# EAGLE design Wolf (EAGLE 7.2.0)
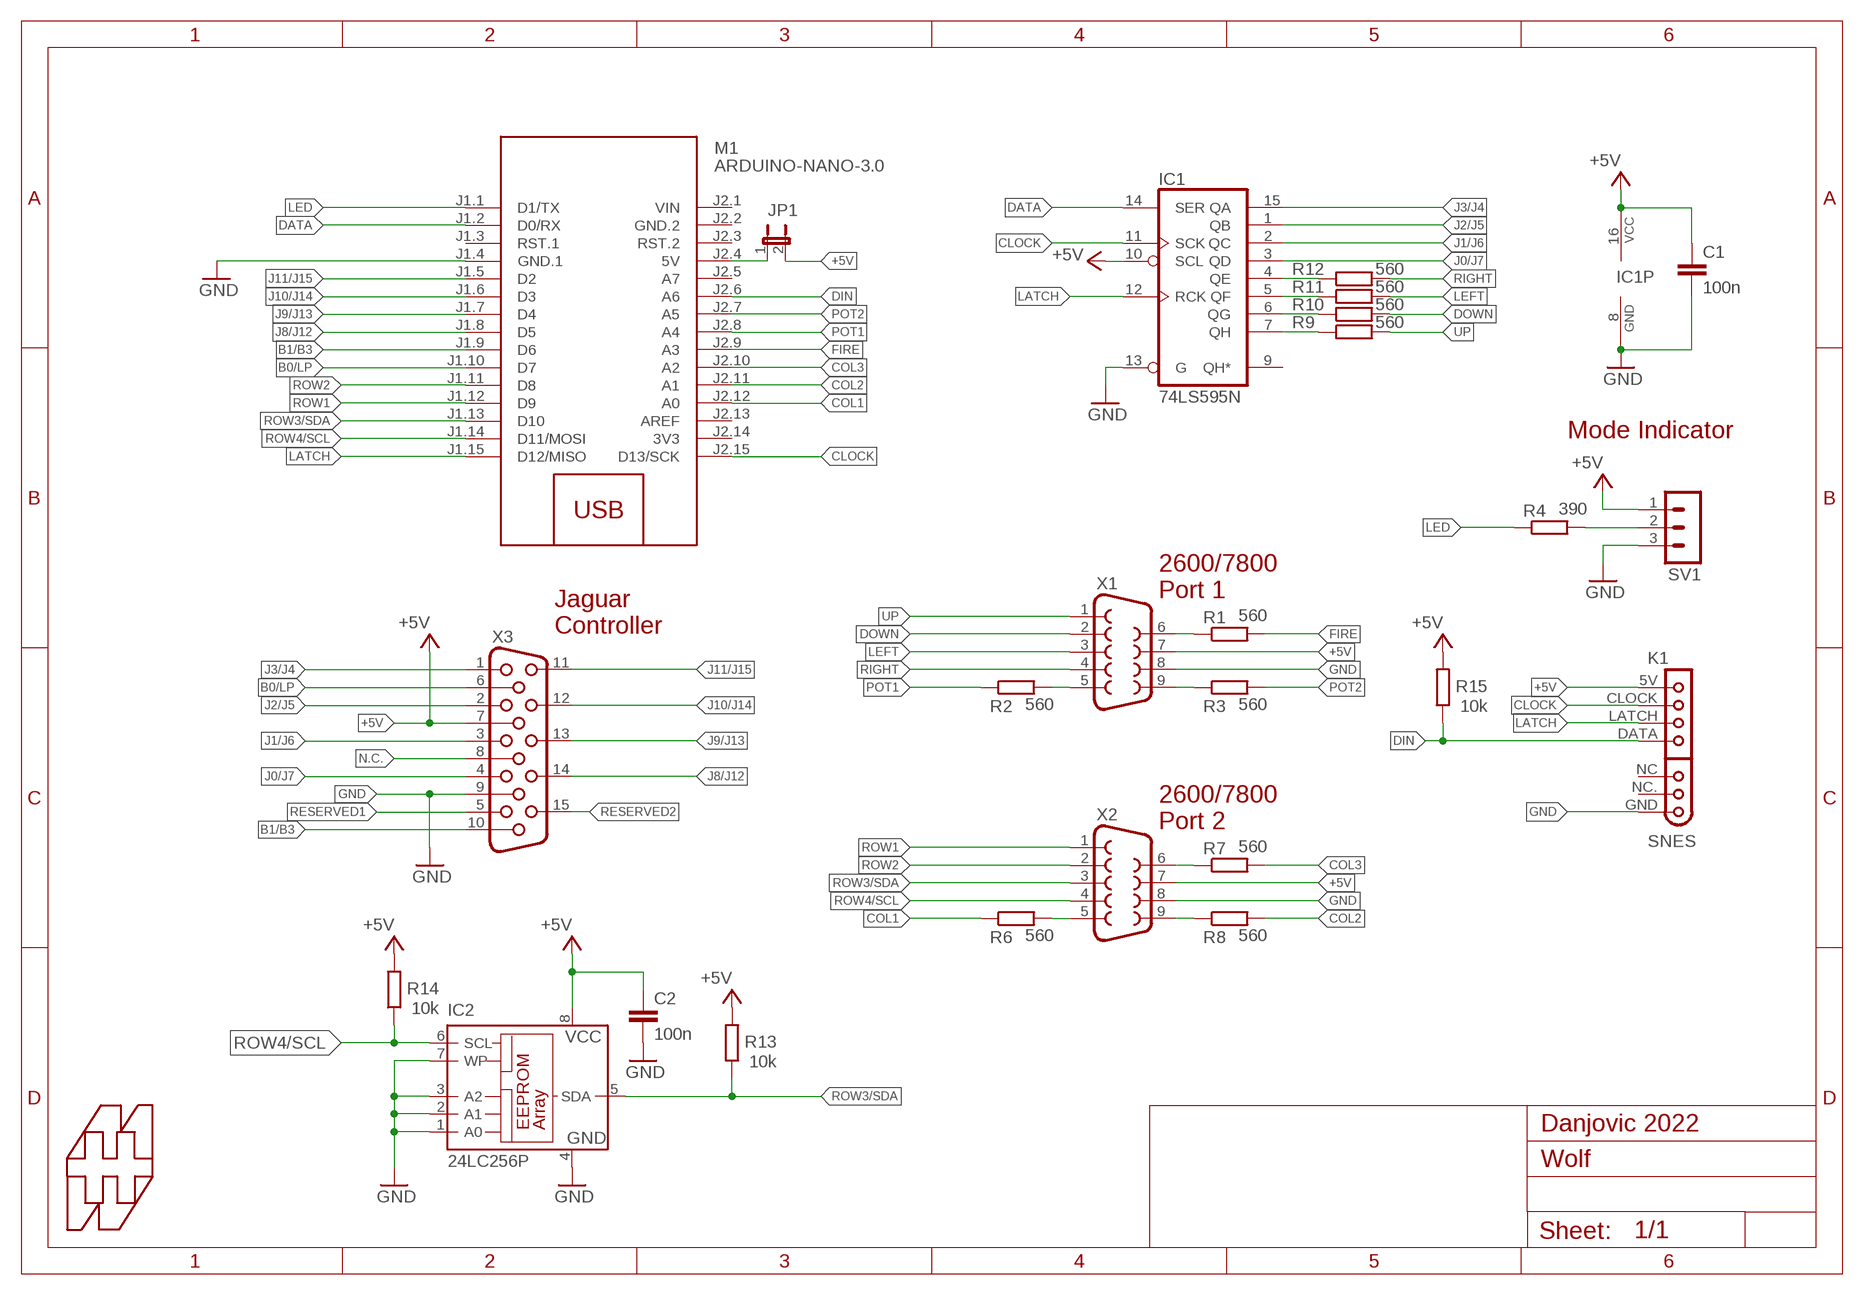
[diagram p0: schematic, sheet 1]

## Parts
C1  100n  C-EU050-024X044  [C050-024X044]
C2  100n  C-EU050-024X044  [C050-024X044]
IC1  74LS595N  [DIL16]
IC2  24LC256P  [DIL8]
JP1  JP1E  [JP1]
K1  SNES  SNES-R  [SNESCON-R]
M1  ARDUINO-NANO-3.0  [ARDUINO-NANO-3.0]
R1  560  R-EU_0204/7  [0204/7]
R2  560  R-EU_0204/7  [0204/7]
R3  560  R-EU_0204/7  [0204/7]
R4  390  R-EU_0204/7  [0204/7]
R6  560  R-EU_0204/7  [0204/7]
R7  560  R-EU_0204/7  [0204/7]
R8  560  R-EU_0204/7  [0204/7]
R9  560  R-EU_0204/7  [0204/7]
R10  560  R-EU_0204/7  [0204/7]
R11  560  R-EU_0204/7  [0204/7]
R12  560  R-EU_0204/7  [0204/7]
R13  10k  R-EU_0204/7  [0204/7]
R14  10k  R-EU_0204/7  [0204/7]
R15  10k  R-EU_0204/7  [0204/7]
SV1  MA03-1  [MA03-1]
U$1  HAMMOND-RL6015  [RL6015]
X1  F09HP  [F09HP]
X2  F09HP  [F09HP]
X3  HF15H  [HDF15H]

## Nets
+5V: C1.1 C2.1 IC1.10(SCL) IC1.16(VCC) IC2.8(VCC) JP1.2 K1.5V R13.2 R14.2 R15.2 SV1.1 X1.7 X2.7 X3.7
B0/LP: M1.J1.10(D7) X3.6
B1/B3: M1.J1.9(D6) X3.10
CLOCK: IC1.11(SCK) K1.CLOCK M1.J2.15(D13/SCK)
COL1: M1.J2.12(A0) R6.1
COL2: M1.J2.11(A1) R8.2
COL3: M1.J2.10(A2) R7.2
DATA: IC1.14(SER) M1.J1.2(D0/RX)
DIN: K1.DATA M1.J2.6(A6) R15.1
DOWN: R10.2 X1.2
FIRE: M1.J2.9(A3) R1.2
GND: C1.2 C2.2 IC1.8(GND) IC1.13(G) IC2.1(A0) IC2.2(A1) IC2.3(A2) IC2.4(GND) IC2.7(WP) K1.GND M1.J1.4(GND.1) SV1.3 X1.8 X2.8 X3.9
J0/J7: IC1.3(QD) X3.4
J1/J6: IC1.2(QC) X3.3
J2/J5: IC1.1(QB) X3.2
J3/J4: IC1.15(QA) X3.1
J8/J12: M1.J1.8(D5) X3.14
J9/J13: M1.J1.7(D4) X3.13
J10/J14: M1.J1.6(D3) X3.12
J11/J15: M1.J1.5(D2) X3.11
LATCH: IC1.12(RCK) K1.LATCH M1.J1.15(D12/MISO)
LED: M1.J1.1(D1/TX) R4.1
LEFT: R11.2 X1.3
N$1: R4.2 SV1.2
N.C.: X3.8
POT1: M1.J2.8(A4) R2.1
POT2: M1.J2.7(A5) R3.2
R_COL1: R6.2 X2.5
R_COL2: R8.1 X2.9
R_COL3: R7.1 X2.6
R_DOWN: IC1.6(QG) R10.1
R_FIRE: R1.1 X1.6
R_LEFT: IC1.5(QF) R11.1
R_POT1: R2.2 X1.5
R_POT2: R3.1 X1.9
R_RIGHT: IC1.4(QE) R12.1
R_UP: IC1.7(QH) R9.1
RESERVED1: X3.5
RESERVED2: X3.15
RIGHT: R12.2 X1.4
ROW1: M1.J1.12(D9) X2.1
ROW2: M1.J1.11(D8) X2.2
ROW3/SDA: IC2.5(SDA) M1.J1.13(D10) R13.1 X2.3
ROW4/SCL: IC2.6(SCL) M1.J1.14(D11/MOSI) R14.1 X2.4
UP: R9.2 X1.1
VCC_ARD: JP1.1 M1.J2.4(5V)
Unconnected: IC1.9(QH*) K1.NC K1.NC. M1.J1.3(RST.1) M1.J2.3(RST.2) M1.J2.5(A7) M1.J2.13(AREF)

## Notes on the sheet
- Mode Indicator
- 2600/7800
  Port 1
- Jaguar
  Controller
- 2600/7800
  Port 2
- Danjovic 2022

## Power pins joined to a net without a drawn wire
3V3: M1.J2.14(3V3)
GND.2: M1.J2.2(GND.2)
VIN: M1.J2.1(VIN)

## Library data of the parts
C1 C2 = rcl:C-EU: CAPACITOR, European symbol
IC1 = 74xx-us:74*595: 8-bit SHIFT REGISTER, output latch
IC2 = microchip:24*: Serial EEPROM I2C; MF: MICROCHIP; MPN: 24LC256-E/P; OC_FARNELL: 9757970; OC_NEWARK: 92C7169
JP1 = jumper:JP1E: JUMPER
K1 = snes_breakout:SNES: SNES HEADER
M1 = diy-modules:ARDUINO-NANO-3.0: Arduino Nano 3.0 and compatible devices More details available here: https://www.arduino.cc/en/Main/ArduinoBoardNano Click here to find device on ebay.com <http://www.ebay.com/sch/arduino+nano>
R1-R4 R6-R15 = rcl:R-EU_: RESISTOR, European symbol
SV1 = con-lstb:MA03-1: PIN HEADER; OC_FARNELL: unknown; OC_NEWARK: unknown
U$1 = box-hammond:HAMMOND-
X1 X2 = con-subd:F09: SUB-D; OC_FARNELL: unknown; OC_NEWARK: unknown
X3 = con-subd:HF15: SUB-D; OC_FARNELL: unknown; OC_NEWARK: unknown

## Board
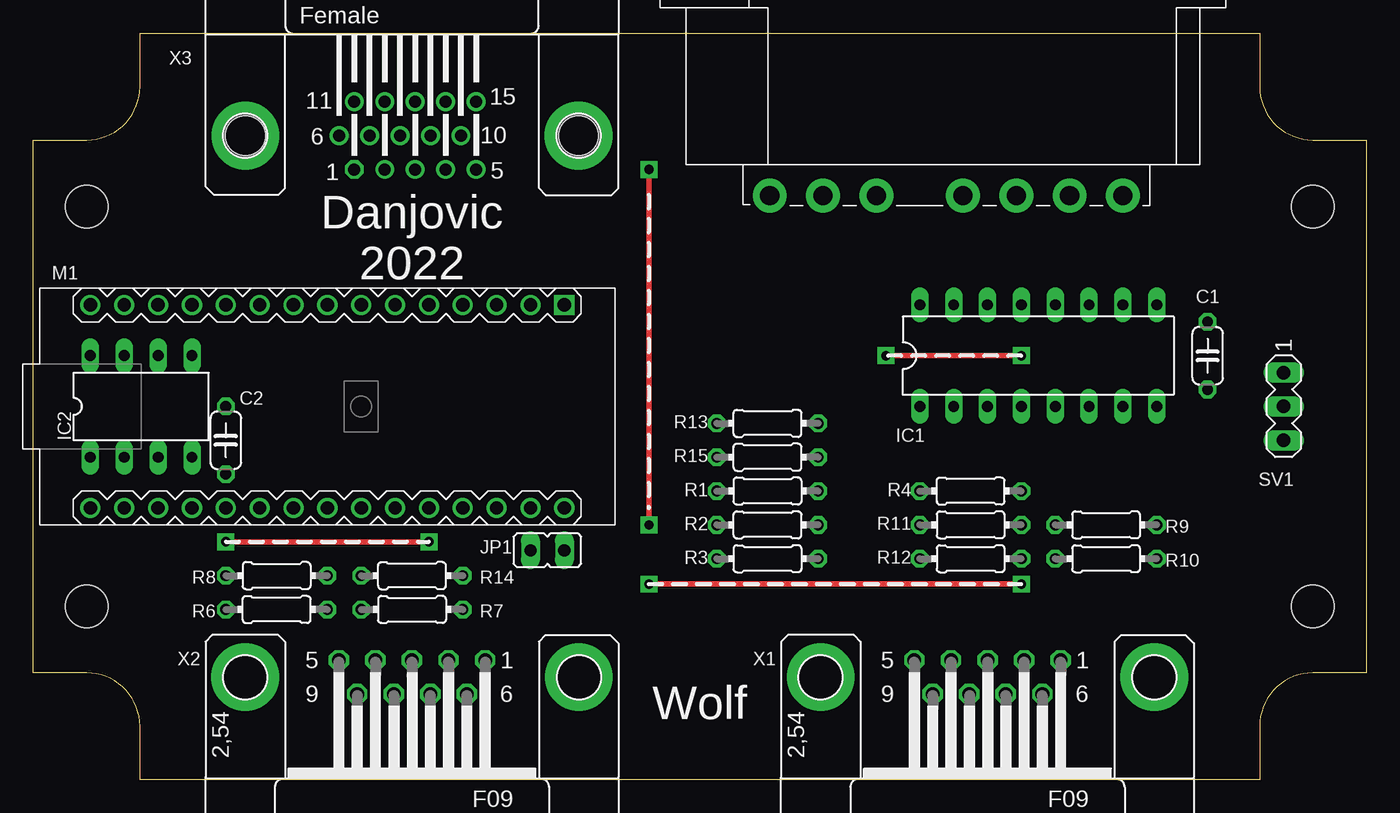
[diagram p1: board, top side]
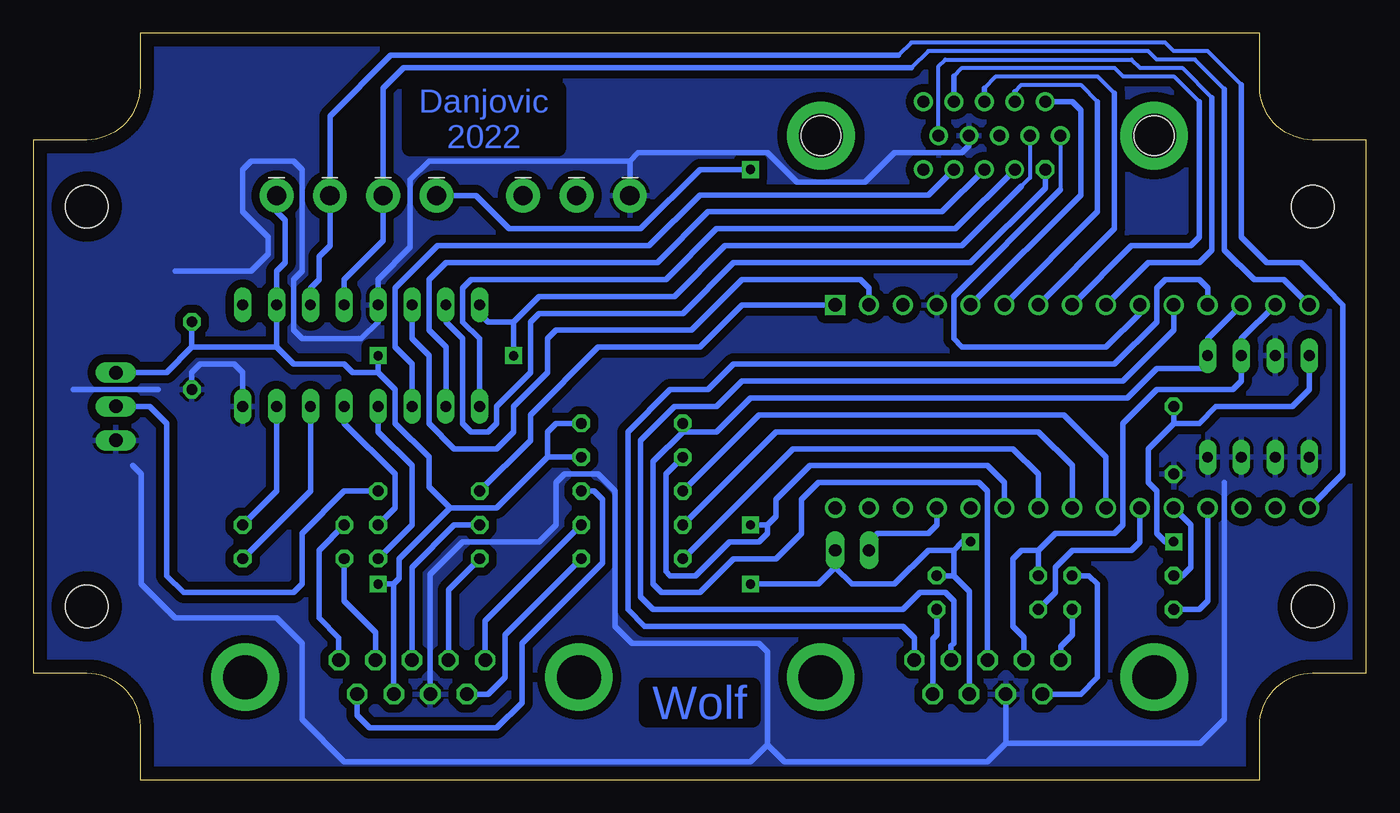
[diagram p2: board, bottom side, seen from below]

Size 100 x 56 mm. Coordinates in mm from the lower left corner, seen from the top.
Copper layers (1*16): Top 0.035mm / dielectric 1.5mm / Bottom 0.035mm
Design rules "default *": minimum track width 10mil, minimum drill 24mil, track to track 8mil, track to pad 8mil, pad to pad 8mil, via to via 8mil, smd to smd 8mil, copper to edge 40mil, drill to drill 8mil, minimum pad ring 10mil, minimum via ring 8mil, stop-mask expansion 4mil, vias tented up to drill 0mil, thermal gap 10mil

### Footprints (pad centres in the part's own frame; a part is rotated, then mirrored left to right if it is on the bottom)
C050-024X044 = drill 0.813 octagon: 1 -2.54,0; 2 2.54,0
DIL16 = drill 0.813 long: 1 -8.89,-3.81; 2 -6.35,-3.81; 3 -3.81,-3.81; 4 -1.27,-3.81; 5 1.27,-3.81; 6 3.81,-3.81; 7 6.35,-3.81; 8 8.89,-3.81; 9 8.89,3.81; 10 6.35,3.81; 11 3.81,3.81; 12 1.27,3.81; 13 -1.27,3.81; 14 -3.81,3.81; 15 -6.35,3.81; 16 -8.89,3.81
DIL8 = drill 0.813 long: 1 -3.81,-3.81; 2 -1.27,-3.81; 3 1.27,-3.81; 4 3.81,-3.81; 5 3.81,3.81; 6 1.27,3.81; 7 -1.27,3.81; 8 -3.81,3.81
JP1 = drill 0.914 long: 1 0,-1.27; 2 0,1.27
SNESCON-R = drill 1.448 pad 2.54: 5V 0,0.254; CLOCK -4,0.254; DATA -12,0.254; GND -26.5,0.254; LATCH -8,0.254; NC -18.5,0.254; NC. -22.5,0.254
ARDUINO-NANO-3.0 = drill 1 square: J1.1 17.78,7.62 | drill 1: J1.2 15.24,7.62; J1.3 12.7,7.62; J1.4 10.16,7.62; J1.5 7.62,7.62; J1.6 5.08,7.62; J1.7 2.54,7.62; J1.8 0,7.62; J1.9 -2.54,7.62; J1.10 -5.08,7.62; J1.11 -7.62,7.62; J1.12 -10.16,7.62; J1.13 -12.7,7.62; J1.14 -15.24,7.62; J1.15 -17.78,7.62; J2.1 17.78,-7.62; J2.2 15.24,-7.62; J2.3 12.7,-7.62; J2.4 10.16,-7.62; J2.5 7.62,-7.62; J2.6 5.08,-7.62; J2.7 2.54,-7.62; J2.8 0,-7.62; J2.9 -2.54,-7.62; J2.10 -5.08,-7.62; J2.11 -7.62,-7.62; J2.12 -10.16,-7.62; J2.13 -12.7,-7.62; J2.14 -15.24,-7.62; J2.15 -17.78,-7.62
0204/7 = drill 0.813 octagon: 1 -3.81,0; 2 3.81,0
MA03-1 = drill 1.016 long: 1 -2.54,0; 2 0,0; 3 2.54,0
RL6015 = hole 3.2: -46,15; -46,-15; 46,-15; 46,15
F09HP = drill 1.016 octagon: 1 -5.486,-1.27; 2 -2.743,-1.27; 3 0,-1.27; 4 2.743,-1.27; 5 5.486,-1.27; 6 -4.115,1.27; 7 -1.372,1.27; 8 1.372,1.27; 9 4.115,1.27 | drill 3.302 pad 5.08: G1 -12.522,0; G2 12.522,0
HDF15H = drill 0.9 octagon: 1 4.329,2.54 | drill 0.9: 2 2.043,2.54; 3 -0.243,2.54; 4 -2.529,2.54; 5 -4.815,2.54; 6 5.472,0; 7 3.186,0; 8 0.9,0; 9 -1.386,0; 10 -3.672,0; 11 4.329,-2.54; 12 2.043,-2.54; 13 -0.243,-2.54; 14 -2.529,-2.54; 15 -4.815,-2.54 | drill 3.302 pad 5.08: G1 -12.5,0; G2 12.5,0 | hole 3: -12.5,0; 12.5,0

### Placement (x,y rotation side)
C1  88.1,31.81 270 top
C2  14.44,25.46 270 top
IC1  75.4,31.81 0 top
IC2  8.09,28 0 top
JP1  38.57,17.2 270 top
K1  81.75,43.56 0 top
M1  22.06,28 0 top
R1  55.08,21.65 180 top
R2  55.08,19.11 0 top
R3  55.08,16.57 180 top
R4  70.32,21.65 0 top
R6  18.25,12.76 0 top
R7  28.41,12.76 180 top
R8  18.25,15.3 180 top
R9  80.48,19.11 180 top
R10  80.48,16.57 180 top
R11  70.32,19.11 180 top
R12  70.32,16.57 180 top
R13  55.08,26.73 0 top
R14  28.41,15.3 0 top
R15  55.08,24.19 0 top
SV1  93.81,28 270 top
U$1  50,28 0 top
X1  71.59,7.68 180 top
X2  28.41,7.68 180 top
X3  28.41,48.32 180 top

### Tracks (layer width: path | path; a pad name or v marks a point on that pad's centre or on a via)
+5V  (via drill 0.7 pad 1.27)
  Top 0.406: v74.13,14.66 v46.19,14.66 | v63.97,31.81 v74.13,31.81 | v14.44,17.84 v29.68,17.84
  Bottom 0.305: X3.7 25.22,45.16 25.86,44.52
  Bottom 0.406: 63.97,34.35 62.07,36.25 51.91,36.25 48.1,40.06 30.32,40.06 25.86,44.52 | 63.97,34.35 65.88,34.35 66.51,34.98 IC1.16 | C1.1 88.1,32.44 | 88.1,32.44 81.75,32.44 | 81.75,32.44 80.48,31.17 76.67,31.17 76.03,30.54 74.13,30.54 | 81.75,32.44 IC1.10 81.75,38.16 81.12,38.8 81.12,41.97 81.75,42.61 K1.5V | 68.73,20.38 72.54,16.57 72.54,15.08 72.96,14.66 | X1.7 72.96,14.66 | 72.96,14.66 v74.13,14.66 | v74.13,31.81 74.13,30.54 | 74.13,30.54 72.86,29.27 72.86,26.73 70.32,24.19 70.32,21.97 68.73,20.38 | v63.97,31.81 63.97,34.35 | IC2.8 4.28,29.27 5.55,28 11.27,28 12.54,26.73 14.44,26.73 | C2.1 14.44,26.73 | 14.44,26.73 16.35,24.82 16.35,22.29 15.71,21.65 15.71,18.47 15.08,17.84 v14.44,17.84 | X2.7 29.78,14.13 30.95,15.3 | 30.95,15.3 30.95,17.2 | 30.95,17.2 30.32,17.84 v29.68,17.84 | 30.95,17.2 32.86,17.2 35.4,14.66 38.57,14.66 39.84,15.93 | v46.19,14.66 41.11,14.66 39.84,15.93 | 30.95,15.3 R14.2 | 61.43,24.19 65.24,20.38 68.73,20.38 | JP1.2 39.84,15.93 | R15.2 61.43,24.19 | R13.2 60.8,26.73 61.43,26.09 61.43,24.19 | SV1.1 90.01,30.54 88.1,32.44
B0/LP
  Bottom 0.305: X3.6 22.94,44.27
  Bottom 0.406: M1.J1.10 16.98,34.98 19.52,32.44 30.32,32.44 30.95,33.08 30.95,36.25 22.94,44.27
B1/B3
  Bottom 0.305: X3.10 32.08,53.54 31.59,54.03 17.62,54.03 16.98,53.4 13.81,53.4 11.58,51.18
  Bottom 0.406: 11.58,51.18 11.58,39.75 12.54,38.8 16.35,38.8 M1.J1.9
CLOCK
  Bottom 0.305: 35.08,54.35 34.12,55.3 15.08,55.3 14.44,54.67 11.9,54.67 9.36,52.13
  Bottom 0.406: M1.J2.15 1.74,22.92 1.74,35.62 3.01,36.89 4.92,38.8 7.46,38.8 9.36,40.7 9.36,52.13 | 35.08,54.35 73.18,54.35 77.75,49.78 K1.CLOCK 77.75,40.06 78.58,39.24 78.58,37.53 79.21,36.89 IC1.11
COL1
  Bottom 0.406: M1.J2.12 11.9,13.39 12.54,12.76 R6.1
COL2
  Bottom 0.406: M1.J2.11 13.17,19.11 13.17,15.93 13.81,15.3 R8.2
COL3
  Bottom 0.406: M1.J2.10 16.98,17.84 17.62,17.2 22.06,17.2 23.33,15.93 23.33,14.03 R7.2
DATA
  Bottom 0.406: IC1.14 71.59,33.08 70.32,31.81 70.32,26.73 68.42,24.82 65.24,24.82 63.97,26.09 63.97,28 61.43,30.54 61.43,33.08 60.8,33.72 50.64,33.72 46.83,37.53 37.94,37.53 37.3,36.89 M1.J1.2
DIN  (via drill 0.7 pad 1.27)
  Top 0.406: v46.19,45.78 v46.19,19.11
  Bottom 0.406: v46.19,19.11 44.92,19.11 | 44.92,19.11 44.29,19.74 44.29,21.01 41.75,23.55 28.41,23.55 27.14,22.29 M1.J2.6 | K1.DATA 66.76,43.81 64.29,41.33 54.45,41.33 50,45.78 v46.19,45.78 | 44.92,19.11 44.92,18.47 45.55,17.84 47.78,17.84 50.32,15.3 52.22,15.3 52.54,15.62 52.54,22.92 R15.1
DOWN
  Bottom 0.406: X1.2 74.33,11.06 76.67,13.39 R10.2
FIRE
  Bottom 0.406: M1.J2.9 19.52,24.19 22.7,27.36 45.55,27.36 R1.2
GND
  Bottom 0.406: X3.9 29.8,47.57 30.32,47.05 35.4,47.05 37.62,44.83 42.7,44.83 44.92,47.05 54.62,47.05 55.25,46.41 | X1.8 70.22,15.4 67.78,17.84 62.07,17.84 60.8,19.11 60.8,22.29 60.16,22.92 57.62,22.92 56.35,21.65 56.35,11.49 55.08,10.22 45.55,10.22 44.92,9.58 44.92,2.6 | 55.25,46.41 70.32,46.41 71.72,45.02 71.72,39.94 74.13,37.53 IC1.13 74.13,34.35 75.4,33.08 79.84,33.08 80.48,33.72 80.48,37.53 79.84,38.16 79.84,45.78 80.48,46.41 83.66,46.41 84.29,45.78 84.29,42.61 82.39,40.7 82.39,39.43 83.66,38.16 89.37,38.16 | 55.25,46.41 K1.GND | IC1.8 84.29,30.54 84.92,31.17 87.47,31.17 88.1,30.54 C1.2 | X2.8 27.04,2.7 | 27.04,2.7 28.41,1.33 43.65,1.33 44.92,2.6 | 10.63,22.29 10.63,4.5 12.43,2.7 27.04,2.7 | 44.92,2.6 46.19,1.33 76.67,1.33 79.84,4.5 79.84,10.22 81.75,12.12 89.37,12.12 91.91,14.66 91.91,22.92 92.55,23.55 | 90.64,29.27 96.99,29.27
  pour Bottom (isolate 0.61): -0.16,56.58 -0.16,-0.58 100.17,-0.58 100.17,56.58
J0/J7
  Bottom 0.406: IC1.3 71.59,31.17 72.86,32.44 72.86,36.89 69.69,40.06 53.81,40.06 50,43.88 32.84,43.88 X3.4
J1/J6
  Bottom 0.406: IC1.2 69.05,32.44 70.32,33.72 70.32,37.53 69.05,38.8 53.18,38.8 49.37,42.61 31.83,42.61 X3.3
J2/J5
  Bottom 0.406: IC1.1 66.51,33.08 67.78,34.35 67.78,36.89 67.14,37.53 52.54,37.53 48.73,41.33 30.81,41.33 X3.2
J3/J4
  Bottom 0.406: IC1.15 69.05,34.35 67.78,33.08 67.78,26.73 67.14,26.09 65.88,26.09 65.24,26.73 65.24,28 62.7,30.54 62.7,34.35 62.07,34.98 51.27,34.98 47.46,38.8 29.68,38.8 24.08,44.39 X3.1
J8/J12
  Bottom 0.305: 30.94,52.78 30.32,53.4 18.89,53.4 18.25,52.77 14.44,52.77 12.54,50.86
  Bottom 0.406: X3.14 30.94,52.78 | 12.54,50.86 12.54,40.7 13.17,40.06 17.62,40.06 M1.J1.8
J9/J13
  Bottom 0.305: 28.65,51.89 27.78,52.77 20.16,52.77 18.89,51.5
  Bottom 0.406: X3.13 28.65,51.89 | 18.89,51.5 18.89,41.33 M1.J1.7
J10/J14
  Bottom 0.305: 26.37,51.63 25.87,52.13 21.43,52.13 20.16,50.86
  Bottom 0.406: X3.12 26.37,51.63 | 20.16,50.86 20.16,42.61 M1.J1.6
J11/J15
  Bottom 0.406: X3.11 22.06,50.86 21.43,50.22 21.43,43.88 M1.J1.5
LATCH
  Bottom 0.305: 10.63,51.81 12.85,54.03 15.71,54.03 16.35,54.67 32.86,54.67 34.12,53.4
  Bottom 0.406: 34.12,53.4 72.23,53.4 73.75,51.88 K1.LATCH 73.75,40.44 76.67,37.53 IC1.12 | M1.J1.15 6.19,37.53 8.41,37.53 10.63,39.75 10.63,51.81
LED
  Bottom 0.406: M1.J1.1 46.83,35.62 50,32.44 57.62,32.44 62.7,27.36 62.7,25.46 R4.1
LEFT
  Bottom 0.406: X1.3 71.59,15.93 68.42,19.11 R11.2
N$1
  Bottom 0.406: R4.2 76.67,21.65 79.84,18.47 79.84,14.66 80.48,14.03 88.73,14.03 90.01,15.3 90.01,26.73 91.28,28 91.91,28 SV1.2
N$3
  pour Bottom (isolate 0.61): 12.54,52.77 18.89,52.77 18.89,40.06 12.54,40.06
POT1
  Bottom 0.406: M1.J2.8 22.06,23.55 24.6,26.09 44.29,26.09 R2.1
POT2
  Bottom 0.406: M1.J2.7 24.6,22.92 26.51,24.82 43.02,24.82 R3.2
R_COL1
  Bottom 0.406: X2.5 22.92,9.99 22.06,10.85 R6.2
R_COL2
  Bottom 0.406: R8.1 20.79,15.3 20.16,14.66 20.16,7.68 21.43,6.41 X2.9
R_COL3
  Bottom 0.406: X2.6 32.53,10.55 32.22,10.85 R7.1
R_DOWN
  Bottom 0.406: IC1.6 79.21,21.65 R10.1
R_FIRE
  Bottom 0.406: X1.6 75.7,4.81 74.77,3.87 65.24,3.87 63.34,5.77 63.34,10.22 57.3,16.25 57.3,21.01 57.94,21.65 R1.1
R_LEFT
  Bottom 0.406: R11.1 72.86,20.38 72.86,22.92 76.67,26.73 IC1.5
R_POT1
  Bottom 0.406: X1.5 66.1,11.9 R2.2
R_POT2
  Bottom 0.406: X1.9 65.88,6.41 64.61,7.68 64.61,10.85 R3.1
R_RIGHT
  Bottom 0.406: R12.1 71.59,19.11 71.59,23.55 74.13,26.09 IC1.4
R_UP
  Bottom 0.406: IC1.7 81.75,21.65 R9.1
RIGHT
  Bottom 0.406: X1.4 68.85,14.23 R12.2
ROW1
  Bottom 0.406: M1.J1.12 11.9,36.89 12.54,37.53 15.08,37.53 15.71,36.89 15.71,34.35 18.89,31.17 47.46,31.17 49.37,29.27 52.22,29.27 55.4,26.09 55.4,12.76 54.13,11.49 34.76,11.49 33.9,10.63 X2.1
ROW2
  Bottom 0.406: M1.J1.11 14.44,33.72 18.25,29.9 46.83,29.9 48.73,28 51.91,28 54.45,25.46 54.45,13.71 53.49,12.76 34.76,12.76 33.49,14.03 31.59,14.03 30.95,13.39 30.95,10.22 31.15,10.02 X2.2
ROW3/SDA
  Bottom 0.406: M1.J1.13 11.9,33.08 IC2.5 11.9,31.17 12.22,30.86 15.71,30.86 17.93,28.63 46.19,28.63 48.73,26.09 51.27,26.09 | X2.3 28.41,21.65 29.05,22.29 40.48,22.29 41.11,22.29 42.38,21.01 42.38,20.38 42.38,18.47 44.29,16.57 47.46,16.57 50,14.03 52.86,14.03 53.49,14.66 53.49,23.87 51.27,26.09 | R13.1 51.27,26.09
ROW4/SCL
  Bottom 0.406: M1.J1.14 9.36,33.08 IC2.6 9.36,29.9 10,29.27 15.71,29.27 18.25,26.73 18.25,19.11 18.89,18.47 23.33,18.47 24.6,17.2 | 24.6,17.2 25.87,17.2 26.51,16.57 26.51,11.49 25.67,10.65 X2.4 | R14.1 24.6,17.2
UP
  Bottom 0.406: R9.2 78.58,17.2 78.58,12.12 77.08,10.63 X1.1
VCC_ARD
  Bottom 0.406: M1.J2.4 32.22,19.11 32.86,18.47 36.67,18.47 37.3,17.84 JP1.1

### Text on the board
Bottom: Danjovic / 2022 | Wolf
tPlace: Danjovic / 2022 | Wolf